# Altium schematic sheet ArduinoProMiniSch.SchDoc
size A4; SheetNumber: 1; SheetTotal: 1
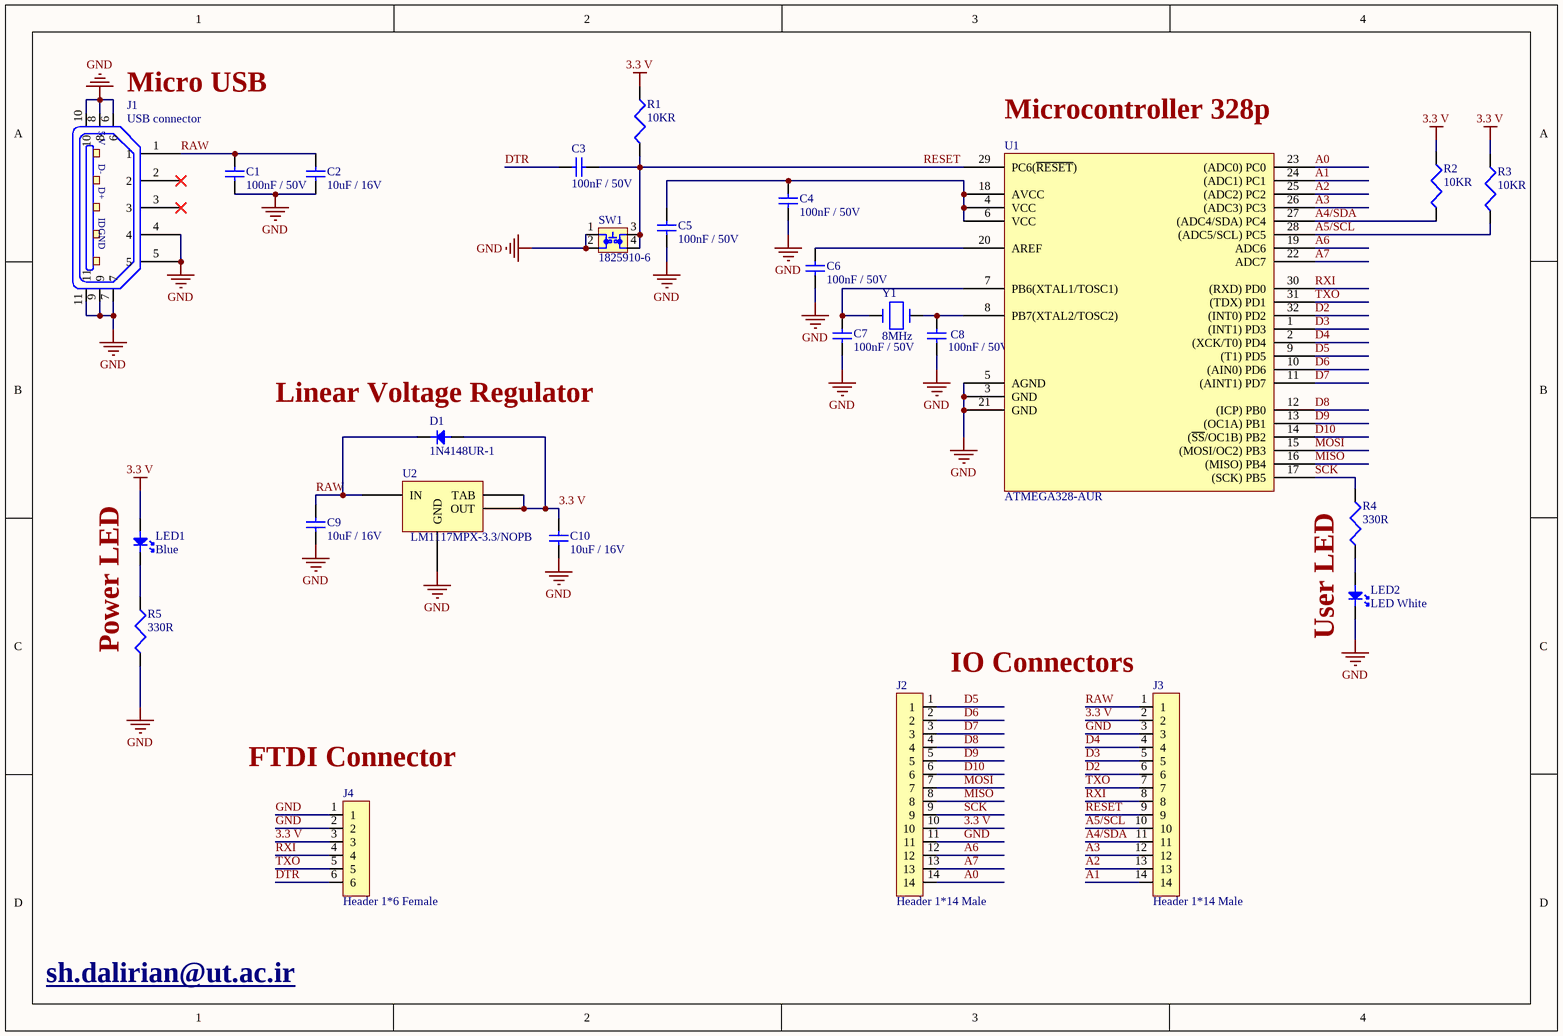
[diagram p0: ArduinoProMiniSch.SchDoc]

## Parts
C1  100nF / 50V  [C 0805]
C2  10uF / 16V  [C 0805]
C3  100nF / 50V  [C 0805]
C4  100nF / 50V  [C 0805]
C5  100nF / 50V  [C 0805]
C6  100nF / 50V  [C 0805]
C7  100nF / 50V  [C 0805]
C8  100nF / 50V  [C 0805]
C9  10uF / 16V  [C 0805]
C10  10uF / 16V  [C 0805]
D1  1N4148UR-1  [DO-213AA]
J1  USB connector  [USB connector]
J2  Header 1*14 Male  [Header 1*14 Male]
J3  Header 1*14 Male  [Header 1*14 Male]
J4  Header 1*6 Female  [Header 1*6 Female]
LED1  Blue  [LED 0603]
LED2  LED White  [LED 0603]
R1  10KR  [R 0805]
R2  10KR  [R 0805]
R3  10KR  [R 0805]
R4  330R  [R 0805]
R5  330R  [R 0805]
SW1  1825910-6  [SW-1825910-6]
U1  ATMEGA328-AUR  [TQFP32]
U2  LM1117MPX-3.3/NOPB  [SOT223]
Y1  8MHz  [CSM-7x]

## Nets
3.3 V: C10.2 D1.1(Anode) J2.10 J3.2 J4.3 LED1.1(Anode) R1.2 R2.2 R3.2 U2.2(OUT) U2.3(TAB)
GND: C1.1 C2.1 C4.1 C5.1 C6.1 C7.1 C8.1 C9.1 C10.1 J1.4 J1.5 J1.6 J1.7 J1.8 J1.9 J1.10 J1.11 J2.11 J3.3 J4.1 J4.2 LED2.2(Cathode) R5.1 SW1.1 SW1.2 U1.3(GND) U1.5(AGND) U1.21(GND) U2.1(GND)
A0: J2.14 U1.23((ADC0)_PC0)
A1: J3.14 U1.24((ADC1)_PC1)
A2: J3.13 U1.25((ADC2)_PC2)
A3: J3.12 U1.26((ADC3)_PC3)
A4/SDA: J3.11 R2.1 U1.27((ADC4/SDA)_PC4)
A5/SCL: J3.10 R3.1 U1.28((ADC5/SCL)_PC5)
A6: J2.12 U1.19(ADC6)
A7: J2.13 U1.22(ADC7)
D2: J3.6 U1.32((INT0)_PD2)
D3: J3.5 U1.1((INT1)_PD3)
D4: J3.4 U1.2((XCK/T0)_PD4)
D5: J2.1 U1.9((T1)_PD5)
D6: J2.2 U1.10((AIN0)_PD6)
D7: J2.3 U1.11((AINT1)_PD7)
D8: J2.4 U1.12((ICP)_PB0)
D9: J2.5 U1.13((OC1A)_PB1)
D10: J2.6 U1.14((~{SS}/OC1B)_PB2)
DTR: C3.1 J4.6
MISO: J2.8 U1.16((MISO)_PB4)
MOSI: J2.7 U1.15((MOSI/OC2)_PB3)
RAW: C1.2 C2.2 C9.2 D1.2(Cathode) J1.1 J3.1 U2.4(IN)
RESET: C3.2 J3.9 R1.1 SW1.3 SW1.4 U1.29(PC6(~{RESET}))
RXI: J3.8 J4.4 U1.30((RXD)_PD0)
SCK: J2.9 R4.2 U1.17((SCK)_PB5)
TXO: J3.7 J4.5 U1.31((TDX)_PD1)
NetC4_2: C4.2 C5.2 U1.4(VCC) U1.6(VCC) U1.18(AVCC)
NetC6_2: C6.2 U1.20(AREF)
NetC7_2: C7.2 U1.7(PB6(XTAL1/TOSC1)) Y1.1
NetC8_2: C8.2 U1.8(PB7(XTAL2/TOSC2)) Y1.2
NetLED1_2: LED1.2(Cathode) R5.2
NetLED2_1: LED2.1(Anode) R4.1

Not connected (* = marked no-connect by the designer): J1 2* 3*

## Notes on the sheet
- (near J1) Micro USB
- (near U1) Microcontroller 328p
- (near D1) Linear Voltage Regulator
- Power LED
- User LED
- IO Connectors
- (near J4) FTDI Connector
- sh.dalirian@ut.ac.ir <www.linkedin.com/in/shadi-d-30174b77>
- (in symbol 10118194-0001LF) 5 V; D-; D+; ID; GND

## Library data of the parts
C1 C3-C8 = C0805C104Z5VACTU: Capacitor; Ceramic; Cap; .100uF; Tol%; -20%; SMT; Vol-Rtg 50V; Y5V; TR | KEMET C0805C104Z5VACTU; Material: 4241ConductorMaterial; Tolerance: 80%; Dissipation Factor: 5%; Supplier: Mouser; Supplier Part Number: 80-C0805C104Z5V; Manufacturer: KEMET; Manufacturer Part Number: C0805C104Z5VACTU; RoHS: Yes; Category: Ceramic Capacitors; Stock: 172361; Pricing: 1=0.1, 10=0.029, 50=0.029, 100=0.018, 1000=0.013, 10000=0.007 (USD); Mounting Technology: Surface Mount,PCB; Case/Package: 0805; Pins: 2NUMBER; Case Code (Metric): 2012; Case Code (Imperial): 0805; Dielectric Material: Ceramic; Min Operating Temperature: -30°C; Max Operating Temperature: 85°C; Package Quantity: 1; Value: 100nF; Voltage Rating: 50V; Packaging: Tape and Reel; Voltage Rating (DC): 50V; Dielectric: Y5V; Termination: SMD/SMT; Voltage: 50V; Series: C0805C; Construction: Flat; Length: 2mm; Width: 0.049inch; Height: 0.9mm; Thickness: 0.039inch; Lead Pitch: 0.75mm; Depth: 1.25mm; Radiation Hardening: No; Reach SVHC Compliant: No; RoHS Compliant: Yes; Lead Free: 5697LeadFree; ComponentLink1URL: https://datasheet.ciiva.com/7842/1470417-7842543.pdf?src-supplier=Element14; ComponentLink1Description: https://datasheet.ciiva.com/7842/1470417-7842543.pdf?src-supplier=Element14; ComponentLink2URL: https://datasheet.ciiva.com/14608/70095383-14608251.pdf?src-supplier=Allied+Electronics; ComponentLink2Description: https://datasheet.ciiva.com/14608/70095383-14608251.pdf?src-supplier=Allied+Electronics; ComponentLink3URL: https://datasheet.ciiva.com/14597/70095383-14597846.pdf?src-supplier=Allied+Electronics; ComponentLink3Description: https://datasheet.ciiva.com/14597/70095383-14597846.pdf?src-supplier=Allied+Electronics
C2 C9 C10 = C0805C106K4PACTU: Ceramic capacitor, 10 µF, 16 V (DC), ±10 %, SMD 0805, X5R, C0805C106K4PAC7800; Manufacturer: KEMET; Material: 4241ConductorMaterial; Tolerance: 10%; Dissipation Factor: 5%; Supplier: Mouser; Supplier Part Number: 80-C0805C106K4P; Manufacturer Part Number: C0805C106K4PACTU; RoHS: Yes; Category: Ceramic Capacitors; Stock: 247073; Pricing: 1=0.16, 10=0.09, 50=0.09, 100=0.056, 1000=0.04, 10000=0.025 (USD); Mounting Technology: Surface Mount; Case/Package: 0805; Pins: 2; Dielectric Material: Ceramic; Case Code (Imperial): 0805; Case Code (Metric): 2012; Min Operating Temperature: -55°C; Max Operating Temperature: 85°C; Value: 10uF; Packaging: Tape and Reel; Dielectric: X5R; Voltage: 16V; Termination: SMD/SMT; Voltage Rating (DC): 16V; Package Quantity: 1; Voltage Rating: 16V; Series: C; Construction: Flat; Length: 2mm; Width: 0.049inch; Height: 1.25mm; Depth: 1.25mm; Thickness: 0.055inch; Radiation Hardening: No; Lead Free: Lead Free; Reach SVHC Compliant: No; RoHS Compliant: Yes; ComponentLink1URL: https://datasheet.ciiva.com/7842/1732713-7842196.pdf?src-supplier=Element14; ComponentLink1Description: https://datasheet.ciiva.com/7842/1732713-7842196.pdf?src-supplier=Element14; ComponentLink2URL: https://datasheet.ciiva.com/28682/1831760-28682305.pdf?src-supplier=Element14; ComponentLink2Description: https://datasheet.ciiva.com/28682/1831760-28682305.pdf?src-supplier=Element14; ComponentLink3URL: https://datasheet.ciiva.com/11787/0900766b8116eb59-11787314.pdf?src-supplier=Rs; ComponentLink3Description: https://datasheet.ciiva.com/11787/0900766b8116eb59-11787314.pdf?src-supplier=Rs; ComponentLink4URL: https://datasheet.ciiva.com/7842/1732713-7842197.pdf?src-supplier=Element14; ComponentLink4Description: https://datasheet.ciiva.com/7842/1732713-7842197.pdf?src-supplier=Element14
D1 = 1N4148UR-1: Rectifier Diode Switching 75V 0.2A 5ns 2-Pin DO-213AA Bag; Manufacturer: Microchip; Forward Current: 100mA; Average Rectified Current: 200mA; Value: 4pF; Element Configuration: 5460ElementConfiguration; Forward Voltage: 1.2V; Max Forward Surge Current (Ifsm): 2A; Max Reverse Current: 500nA; Supplier: Digikey; Supplier Part Number: 1N4148UR-1-ND; Manufacturer Part Number: 1N4148UR-1; RoHS: No; Category: Rectifier Diodes; Stock: 66011; Pricing: 1=0.91, 100=0.85 (USD); Mounting Technology: 8Mount; Pins: 2NUMBER; Min Operating Temperature: -65°C; Max Operating Temperature: 175°C; Max Repetitive Reverse Voltage (Vrrm): 75V; Max Reverse Voltage (DC): 75V; Packaging: 14Packaging; Peak Non-Repetitive Surge Current: 2A; Reverse Recovery Time: 5ns; Reverse Voltage: 75V; Height: 1.7mm; Radiation Hardening: 5898YesNo; Lead Free: 5697LeadFree
J1 = 10118194-0001LF: CONN USB MICRO B RECPT SMT R/A; Manufacturer: Amphenol ICC / FCI; Connector Type: USB,Receptacle; Number of Contacts: 5; Gender: Receptacle; Current Rating: 1.8A; Insulation Resistance: 1GR; Number of Ports: 1; Max Voltage Rating (AC): 100V; Supplier: Digikey; Supplier Part Number: 609-4618-1-ND; Manufacturer Part Number: 10118194-0001LF; RoHS: No; Category: LDO; Stock: 43110; Pricing: 1=0.43, 10=0.367, 25=0.3436, 50=0.3272, 100=0.3116, 250=0.29204, 500=0.27808 (USD); Mounting Technology: Surface Mount,Horizontal; Pins: 5; Color: Black; Contact Material: Copper Alloy; Contact Plating: Gold; Housing Material: Polymer; Min Operating Temperature: -55°C; Max Operating Temperature: 85°C; Features: Shielded; Packaging: Tape and Reel; Termination: Solder; Orientation: Right Angle; Series: -; Package Quantity: 9600; Length: 8.05mm; Depth: 5mm; Flammability Rating: UL94 V-0
J2 J3 = PH1-14-UA: Conn Unshrouded Header HDR 14 POS 2.54mm Solder ST Thru-Hole Bag; Manufacturer: Adam Equipment; Number of Positions: 14; Voltage Rating (AC): 250V; Supplier: Digikey; Supplier Part Number: 2057-PH1-14-UA-ND; Manufacturer Part Number: PH1-14-UA; RoHS: Yes; Category: Connectors; Stock: 9456; Pricing: 1=0.19, 10=0.158, 100=0.1345, 500=0.12, 1000=0.11426, 5000=0.10199, 10000=0.09712 (USD); Mounting Technology: Through Hole; Contact Material: Brass; Contact Shape: Square; Contact Finish - Mating: GOLD; Insulation Material: PBT; Insulation Color: Black; Min Operating Temperature: -40°C; Max Operating Temperature: 105°C; Connector Type: Header; Fastening Type: Pull; Series: PH1; Packaging: Bulk; Contact Type: Male Pin; Number of Rows: 1; Termination: Solder; Lead Free: Lead Free; Flammability Rating: UL94 V-0; ComponentLink1URL: https://datasheet.ciiva.com/16480/catpg250-254-16480235.pdf?src-supplier=Future+Electronics; ComponentLink1Description: https://datasheet.ciiva.com/16480/catpg250-254-16480235.pdf?src-supplier=Future+Electronics
J4 = M20-7820646: 2.54mm (0.1") Pitch SIL Vertical PC Tail Socket Assembly, tin, 6 contacts; Manufacturer: Harwin; Connector Type: Receptacle; Number of Positions: 6; Voltage Rating: 1kV; Mated Stacking Heights: 12.63mm; Supplier: Digikey; Supplier Part Number: 952-1809-ND; Manufacturer Part Number: M20-7820646; RoHS: Yes; Category: Headers and Wire Housings; Stock: 1820; Pricing: 1=1.11, 36=0.86417, 108=0.79954, 504=0.7171, 1008=0.68287, 5004=0.60989, 10008=0.58081 (USD); Mounting Technology: Through Hole; Case/Package: SIL; Contact Plating: Tin; Contact Material: Bronze; Contact Finish - Mating: TIN; Insulation Color: Black; Insulation Material: Nylon; Contact Shape: Square; Min Operating Temperature: -40°C; Max Operating Temperature: 105°C; Packaging: Rail/Tube; Number of Rows: 1; Contact Gender: Female; Package Quantity: 38; Termination: Solder; Number of Contacts: 6; Series: M20; Contact Type: Female Socket; Fastening Type: Pull; Pitch: 2.54mm; Radiation Hardening: No; RoHS Compliant: Yes; Flammability Rating: UL94 V-0; ComponentLink1URL: https://cdn.harwin.com/pdfs/Harwin_PC_Connectors_M20.pdf?src-supplier=Rs; ComponentLink1Description: https://cdn.harwin.com/pdfs/Harwin_PC_Connectors_M20.pdf?src-supplier=Rs; ComponentLink2URL: http://www.harwin.com/include/downloads/pdfs/2010PAGE120.PDF?src-supplier=Avnet; ComponentLink2Description: http://www.harwin.com/include/downloads/pdfs/2010PAGE120.PDF?src-supplier=Avnet; ComponentLink3URL: https://cdn.harwin.com/pdfs/M20-782.pdf?src-supplier=Digikey; ComponentLink3Description: https://cdn.harwin.com/pdfs/M20-782.pdf?src-supplier=Digikey; ComponentLink4URL: https://cdn.harwin.com/pdfs/Harwin_PC_Connectors_M20.pdf?src-supplier=Mouser; ComponentLink4Description: https://cdn.harwin.com/pdfs/Harwin_PC_Connectors_M20.pdf?src-supplier=Mouser; ComponentLink5URL: https://cdn.harwin.com/pdfs/Harwin_PC_Connectors_M20.pdf?src-supplier=TTI; ComponentLink5Description: https://cdn.harwin.com/pdfs/Harwin_PC_Connectors_M20.pdf?src-supplier=TTI; ComponentLink6URL: https://datasheet.octopart.com/M20-7820646-Harwin-datasheet-188872139.pdf?src-supplier=TME; ComponentLink6Description: https://datasheet.octopart.com/M20-7820646-Harwin-datasheet-188872139.pdf?src-supplier=TME
LED1 = LTST-C194TBKT: LED BLUE CLEAR 0603 SMD; Manufacturer: Vishay Lite-On; Supplier: Digikey; Supplier Part Number: 160-1837-1-ND; Manufacturer Part Number: LTST-C194TBKT; RoHS: Yes; Category: LEDs; Stock: 57720; Pricing: 1=0.22, 10=0.15, 100=0.1045, 500=0.08376, 1000=0.07688, 2000=0.07101 (USD); ComponentLink1URL: https://datasheet.ciiva.com/2115/ltst-c194tbkt-2115056.pdf?src-supplier=Digikey; ComponentLink1Description: https://datasheet.ciiva.com/2115/ltst-c194tbkt-2115056.pdf?src-supplier=Digikey; ComponentLink2URL: https://datasheet.ciiva.com/4689/lite-on-ltst-c194tbkt-187209-4689177.pdf?src-supplier=Mouser; ComponentLink2Description: https://datasheet.ciiva.com/4689/lite-on-ltst-c194tbkt-187209-4689177.pdf?src-supplier=Mouser; ComponentLink3URL: https://datasheet.ciiva.com/2115/s-110-ltst-c194tbkt-2115057.pdf?src-supplier=Digikey; ComponentLink3Description: https://datasheet.ciiva.com/2115/s-110-ltst-c194tbkt-2115057.pdf?src-supplier=Digikey
LED2 = IN-S63AT5UW: SMD LED - Mono Color Top View, 0603 0.40mm LED PCB Type, White, High Brightness, Clear Lens, Angle 120; Manufacturer: Inolux; Shape: Rectangular; Lens Style: Flat; Luminous Intensity: 900mcd; Forward Voltage: 3V; Test Current: 5mA; Viewing Angle: 120°; Forward Current: 25mA; Power Dissipation: 75mW; Reverse Voltage: 5V; Number of Circuits: 1; Lens Size: 0.8mm; Supplier: Digikey; Supplier Part Number: 1830-1063-1-ND; Manufacturer Part Number: IN-S63AT5UW; RoHS: No; Category: LEDs; Pricing: 1=0.17, 10=0.118, 100=0.0817, 500=0.065, 1000=0.05945, 2000=0.05472 (USD); Mounting Technology: Surface Mount; Case/Package: 0603; Pins: 2; Color: White; Lens Color: Clear; Case Code (Imperial): 0603; Case Code (Metric): 1608; Min Operating Temperature: -40°C; Max Operating Temperature: 85°C; Packaging: Cut Tape; Lens Transparency: Clear; Series: IN-S63AT; Length: 1.6mm; Width: 0.8mm; Height: 0.4mm; Terminal Pitch: 1.5mm; Reach SVHC Compliant: Yes; ComponentLink1URL: http://www.inolux-corp.com/datasheet/SMDLED/Mono%20Color%20Top%20View/IN-S63AT%20Series_V1.1.pdf?src-supplier=Digikey; ComponentLink1Description: http://www.inolux-corp.com/datasheet/SMDLED/Mono%20Color%20Top%20View/IN-S63AT%20Series_V1.1.pdf?src-supplier=Digikey
R1-R3 = RC0805FR-0710KL: Res Thick Film 0805 10K Ohm 1% 0.125W(1/8W) +/-100ppm/C Epoxy Pad SMD T/R; Manufacturer: Yageo; Voltage Rating: 150V; Temperature Coefficient: 100ppm/°C; Power Rating: 125mW; Supplier: Future Electronics; Supplier Part Number: 3310877; Manufacturer Part Number: RC0805FR-0710KL; RoHS: Yes; Category: Chip SMD Resistors; Stock: 7805000; Pricing: 5000=0.0018, 25000=0.0017, 125000=0.0017, 375000=0.0016, 1000000=0.0015 (USD); Case/Package: 0805; Case Code (Imperial): 0805; Case Code (Metric): 2012; Min Operating Temperature: -55°C; Max Operating Temperature: 155°C; Packaging: Tape and Reel; Value: 10kR; Tolerance: 1%; Termination: SMD/SMT; Package Quantity: 1; Resistor Type: Thick Film; Number of Terminations: 2; Max Power Dissipation: 125mW; Features: Moisture Resistant; Series: RC; Voltage Rating (AC): 150V; Construction: Rectangular; Resistance Tolerance: 1%; Technology: THICK FILM; Length: 0.079inch; Width: 0.049inch; Height: 0.024inch; Depth: 1.25mm; Reach SVHC Compliant: Unknown; Lead Free: Lead Free; Military Standard: Not; RoHS Compliant: Yes; ComponentLink1URL: https://datasheet.ciiva.com/11808/0900766b8106beab-11808151.pdf?src-supplier=Rs; ComponentLink1Description: https://datasheet.ciiva.com/11808/0900766b8106beab-11808151.pdf?src-supplier=Rs; ComponentLink2URL: https://datasheet.ciiva.com/46447/444164-46447563.pdf?src-supplier=Element14; ComponentLink2Description: https://datasheet.ciiva.com/46447/444164-46447563.pdf?src-supplier=Element14; ComponentLink3URL: https://datasheet.ciiva.com/2456/pyu-r-int-thick-7-2456973.pdf?src-supplier=Digikey; ComponentLink3Description: https://datasheet.ciiva.com/2456/pyu-r-int-thick-7-2456973.pdf?src-supplier=Digikey; ComponentLink4URL: https://datasheet.ciiva.com/2456/pyu-r-int-thick-7-2456974.pdf?src-supplier=Digikey; ComponentLink4Description: https://datasheet.ciiva.com/2456/pyu-r-int-thick-7-2456974.pdf?src-supplier=Digikey; ComponentLink5URL: https://datasheet.ciiva.com/2456/pyu-r-int-thick-7-2456972.pdf?src-supplier=Digikey; ComponentLink5Description: https://datasheet.ciiva.com/2456/pyu-r-int-thick-7-2456972.pdf?src-supplier=Digikey; ComponentLink6URL: https://datasheet.ciiva.com/12669/rc0805-12669688.pdf?src-supplier=Mouser; ComponentLink6Description: https://datasheet.ciiva.com/12669/rc0805-12669688.pdf?src-supplier=Mouser; ComponentLink7URL: https://datasheet.ciiva.com/16747/rc0805-16747087.pdf?src-supplier=Future+Electronics; ComponentLink7Description: https://datasheet.ciiva.com/16747/rc0805-16747087.pdf?src-supplier=Future+Electronics
R4 R5 = RC0805JR-07330RL: SMD Chip Resistor 330 Ohm ½ 5% 125 Mw 0805 [2012 Metric] Thick Film General Purpose; Manufacturer: Yageo; Voltage Rating (AC): 150V; Supplier: Rs; Supplier Part Number: 2427101; Manufacturer Part Number: RC0805JR-07330RL; RoHS: Yes; Category: Chip SMD Resistors; Stock: 17600; Pricing: 100=0.007, 1000=0.006, 2500=0.005, 5000=0.004, 10000=0.003 (GBP); Lead Free: 5697LeadFree; ComponentLink1URL: https://datasheet.ciiva.com/12555/rc0805-257173-12555078.pdf?src-supplier=Mouser; ComponentLink1Description: https://datasheet.ciiva.com/12555/rc0805-257173-12555078.pdf?src-supplier=Mouser; ComponentLink2URL: https://datasheet.ciiva.com/46395/444164-46395119.pdf?src-supplier=Element14; ComponentLink2Description: https://datasheet.ciiva.com/46395/444164-46395119.pdf?src-supplier=Element14; ComponentLink3URL: https://datasheet.ciiva.com/7941/442941-7941941.pdf?src-supplier=Element14; ComponentLink3Description: https://datasheet.ciiva.com/7941/442941-7941941.pdf?src-supplier=Element14; ComponentLink4URL: https://datasheet.ciiva.com/7941/442941-7941942.pdf?src-supplier=Element14; ComponentLink4Description: https://datasheet.ciiva.com/7941/442941-7941942.pdf?src-supplier=Element14; ComponentLink5URL: https://datasheet.ciiva.com/17008/rc0805-17008395.pdf?src-supplier=Future+Electronics; ComponentLink5Description: https://datasheet.ciiva.com/17008/rc0805-17008395.pdf?src-supplier=Future+Electronics
SW1 = 1825910-6: Switch Tactile OFF (ON) SPST Round Button PC Pins 0.05A 24VDC 1.57N Thru-Hole Loose; Manufacturer: TE Connectivity Alcoswitch; Mechanical Life: 100000Cycles; Actuator Material: PBT; Operating Force: 160gf; Illumination Type: Non-Illuminated,Illuminated; Switch Travel: 0.25mm; Contact Current Rating: 50mA; Switch Function: Off-Mom; Actuator Type: Standard; Max Voltage Rating (DC): 24V; Insulation Resistance: 100MR; Number of Positions: 2NUMBER; Actuator Length: 0.055inch; Supplier: Future Electronics; Supplier Part Number: 9026957; Manufacturer Part Number: 1825910-6; RoHS: Yes; Category: Pushbutton Switches; Stock: 63628; Pricing: 750=0.0353, 3000=0.0342, 7500=0.0335, 18750=0.0328, 30000=0.0317 (USD); Mounting Technology: Through Hole; Contact Material: Copper Alloy; Contact Plating: Silver; Color: 46Colour; Material: 4261ConductorMaterial; Min Operating Temperature: -35°C; Max Operating Temperature: 85°C; Throw Configuration: SPST; Packaging: Loose Piece; Termination: PC Pins; Type: Switch; Series: FSMJ; Max Current Rating: 50mA; Current Rating: 50mA; Length: 5.99mm; Width: 6mm; RoHS Compliant: Yes; ELV: 5681ELVCompliant; Lead Free: 5697LeadFree; Reach SVHC Compliant: Unknown
U1 = ATMEGA328-AUR: MCU 8-bit ATmega AVR RISC 32KB Flash 2.5V/3.3V/5V 32-Pin TQFP T/R - Tape and Reel; Manufacturer: Microchip; Interface: I2C,SPI,UART,USART; Oscillator Type: Internal; Peripherals: Brown-out Detect/Reset,POR,PWM,WDT,HLVD; Number of I/Os: 23; Core Architecture: PIC; RAM Size: 2KB; Min Supply Voltage: 1.8V; Max Supply Voltage: 5.5V; Data Bus Width: 8b; Clock Frequency: 20MHz; Number of Programmable I/O: 23NUMBER; Number of Timers/Counters: 3NUMBER; Watchdog Timer: 5512WatchdogTimer; Supplier: Digikey; Supplier Part Number: ATMEGA328-AURCT-ND; Manufacturer Part Number: ATMEGA328-AUR; RoHS: Yes; Category: Microcontrollers; Stock: 16791; Pricing: 1=2.51, 25=2.31, 100=2.1 (USD); Mounting Technology: Surface Mount; Case/Package: TQFP; Pins: 32; Contact Plating: 154ConductorMaterial; Min Operating Temperature: -40°C; Max Operating Temperature: 85°C; Packaging: Cut Tape; Memory Format: FLASH; Memory Size: 32KB; Series: PIC® XLP™ 18F; Frequency: 20MHz; RoHS Compliant: Yes; Reach SVHC Compliant: No; ComponentLink1URL: http://www.farnell.com/datasheets/2047852.pdf?src-supplier=Farnell; ComponentLink1Description: http://www.farnell.com/datasheets/2047852.pdf?src-supplier=Farnell; ComponentLink2URL: http://www.farnell.com/datasheets/2047852.pdf?src-supplier=Newark; ComponentLink2Description: http://www.farnell.com/datasheets/2047852.pdf?src-supplier=Newark; ComponentLink3URL: http://www.microchip.com/mymicrochip/filehandler.aspx?ddocname=en589968&src-supplier=Digikey; ComponentLink3Description: http://www.microchip.com/mymicrochip/filehandler.aspx?ddocname=en589968&src-supplier=Digikey; ComponentLink4URL: https://datasheet.octopart.com/ATMEGA328-AUR-Microchip-datasheet-62316222.pdf?src-supplier=Element14; ComponentLink4Description: https://datasheet.octopart.com/ATMEGA328-AUR-Microchip-datasheet-62316222.pdf?src-supplier=Element14; ComponentLink5URL: https://datasheet.octopart.com/ATMEGA328-AUR-Microchip-datasheet-133520744.pdf?src-supplier=Future+Electronics; ComponentLink5Description: https://datasheet.octopart.com/ATMEGA328-AUR-Microchip-datasheet-133520744.pdf?src-supplier=Future+Electronics; ComponentLink6URL: https://datasheet.octopart.com/ATMEGA328-AUR-Microchip-datasheet-14353408.pdf?src-supplier=Newark; ComponentLink6Description: https://datasheet.octopart.com/ATMEGA328-AUR-Microchip-datasheet-14353408.pdf?src-supplier=Newark; ComponentLink7URL: https://datasheet.octopart.com/ATMEGA328-AUR-Atmel-datasheet-14421303.pdf?src-supplier=Farnell; ComponentLink7Description: https://datasheet.octopart.com/ATMEGA328-AUR-Atmel-datasheet-14421303.pdf?src-supplier=Farnell; ComponentLink8URL: https://datasheet.octopart.com/ATMEGA328-AUR-Microchip-datasheet-68295846.pdf?src-supplier=SHENGYU+ELECTRONICS; ComponentLink8Description: https://datasheet.octopart.com/ATMEGA328-AUR-Microchip-datasheet-68295846.pdf?src-supplier=SHENGYU+ELECTRONICS; ComponentLink9URL: https://datasheet.octopart.com/ATMEGA328-AUR-Microchip-datasheet-154741723.pdf?src-supplier=Electro+Sonic; ComponentLink9Description: https://datasheet.octopart.com/ATMEGA328-AUR-Microchip-datasheet-154741723.pdf?src-supplier=Electro+Sonic; Parameter 1: *
U2 = LM1117MPX-3.3/NOPB: 800-mA 15-V linear voltage regulator ; 4-SOT-223 0 to 125; Manufacturer: Texas Instruments; Min Current Limit: 800mA; Number of Channels: 1NUMBER; Supplier: Mouser; Supplier Part Number: 926-LM1117MPX3.3NOPB; Manufacturer Part Number: LM1117MPX-3.3/NOPB; RoHS: Yes; Category: Voltage Regulators - Linear; Stock: 10836; Pricing: 1=0.95, 10=0.685, 50=0.621, 100=0.551, 1000=0.48, 10000=0.454 (USD); Thickness: 1.6mm; Radiation Hardening: 5898YesNo; Lead Free: 5697LeadFree; ComponentLink1URL: http://www.jameco.com/Jameco/Products/ProdDS/1282978.pdf?src-supplier=Jameco; ComponentLink1Description: http://www.jameco.com/Jameco/Products/ProdDS/1282978.pdf?src-supplier=Jameco; ComponentLink2URL: http://www.mouser.com/ds/2/405/snos412m-286860.pdf?src-supplier=Mouser; ComponentLink2Description: http://www.mouser.com/ds/2/405/snos412m-286860.pdf?src-supplier=Mouser; ComponentLink3URL: http://components.arrow.com/part/dataview/41724903S9714588N1317?src-supplier=Arrow+Electronics; ComponentLink3Description: http://components.arrow.com/part/dataview/41724903S9714588N1317?src-supplier=Arrow+Electronics; ComponentLink4URL: http://www.ti.com/general/docs/lit/getliterature.tsp?genericPartNumber=LM1117&fileType=pdf&src-supplier=Farnell; ComponentLink4Description: http://www.ti.com/general/docs/lit/getliterature.tsp?genericPartNumber=LM1117&fileType=pdf&src-supplier=Farnell; ComponentLink5URL: http://www.ti.com/general/docs/lit/getliterature.tsp?genericPartNumber=LM1117&&fileType=pdf&src-supplier=Farnell; ComponentLink5Description: http://www.ti.com/general/docs/lit/getliterature.tsp?genericPartNumber=LM1117&&fileType=pdf&src-supplier=Farnell; ComponentLink6URL: http://www.ti.com/lit/ds/symlink/lm1117.pdf?src-supplier=Digikey; ComponentLink6Description: http://www.ti.com/lit/ds/symlink/lm1117.pdf?src-supplier=Digikey; ComponentLink7URL: http://www.ti.com/general/docs/lit/getliterature.tsp?genericPartNumber=LM1117&fileType=pdf&src-supplier=Newark; ComponentLink7Description: http://www.ti.com/general/docs/lit/getliterature.tsp?genericPartNumber=LM1117&fileType=pdf&src-supplier=Newark; ComponentLink8URL: http://www.ti.com/general/docs/lit/getliterature.tsp?genericPartNumber=LM1117&&fileType=pdf&src-supplier=Avnet; ComponentLink8Description: http://www.ti.com/general/docs/lit/getliterature.tsp?genericPartNumber=LM1117&&fileType=pdf&src-supplier=Avnet
Y1 = ECS-80-18-5PX-TR: Crystal 8MHz ±30ppm (Tol) ±50ppm (Stability) 18pF FUND 60Ohm 2-Pin HC-49/USX SMD T/R; Manufacturer: ECS International; Supplier: Digikey; Supplier Part Number: XC1271CT-ND; Manufacturer Part Number: ECS-80-18-5PX-TR; RoHS: Yes; Category: Crystals; Stock: 23271; Pricing: 1=0.3, 10=0.259, 50=0.235, 100=0.2254, 500=0.2043 (USD); ComponentLink1URL: https://datasheet.ciiva.com/852/csm-7x-852380.pdf?src-supplier=Digikey; ComponentLink1Description: https://datasheet.ciiva.com/852/csm-7x-852380.pdf?src-supplier=Digikey; ComponentLink2URL: https://datasheet.ciiva.com/852/csm-7x-852381.pdf?src-supplier=Digikey; ComponentLink2Description: https://datasheet.ciiva.com/852/csm-7x-852381.pdf?src-supplier=Digikey; ComponentLink3URL: https://datasheet.ciiva.com/852/csm-7x-852382.pdf?src-supplier=Digikey; ComponentLink3Description: https://datasheet.ciiva.com/852/csm-7x-852382.pdf?src-supplier=Digikey